# Altium schematic sheet FPGA_Banks1.SchDoc: FPGA Banks 1
size A4; Engineer: Samer Kilani; DocumentNumber: 6; SheetNumber: 6; SheetTotal: 9
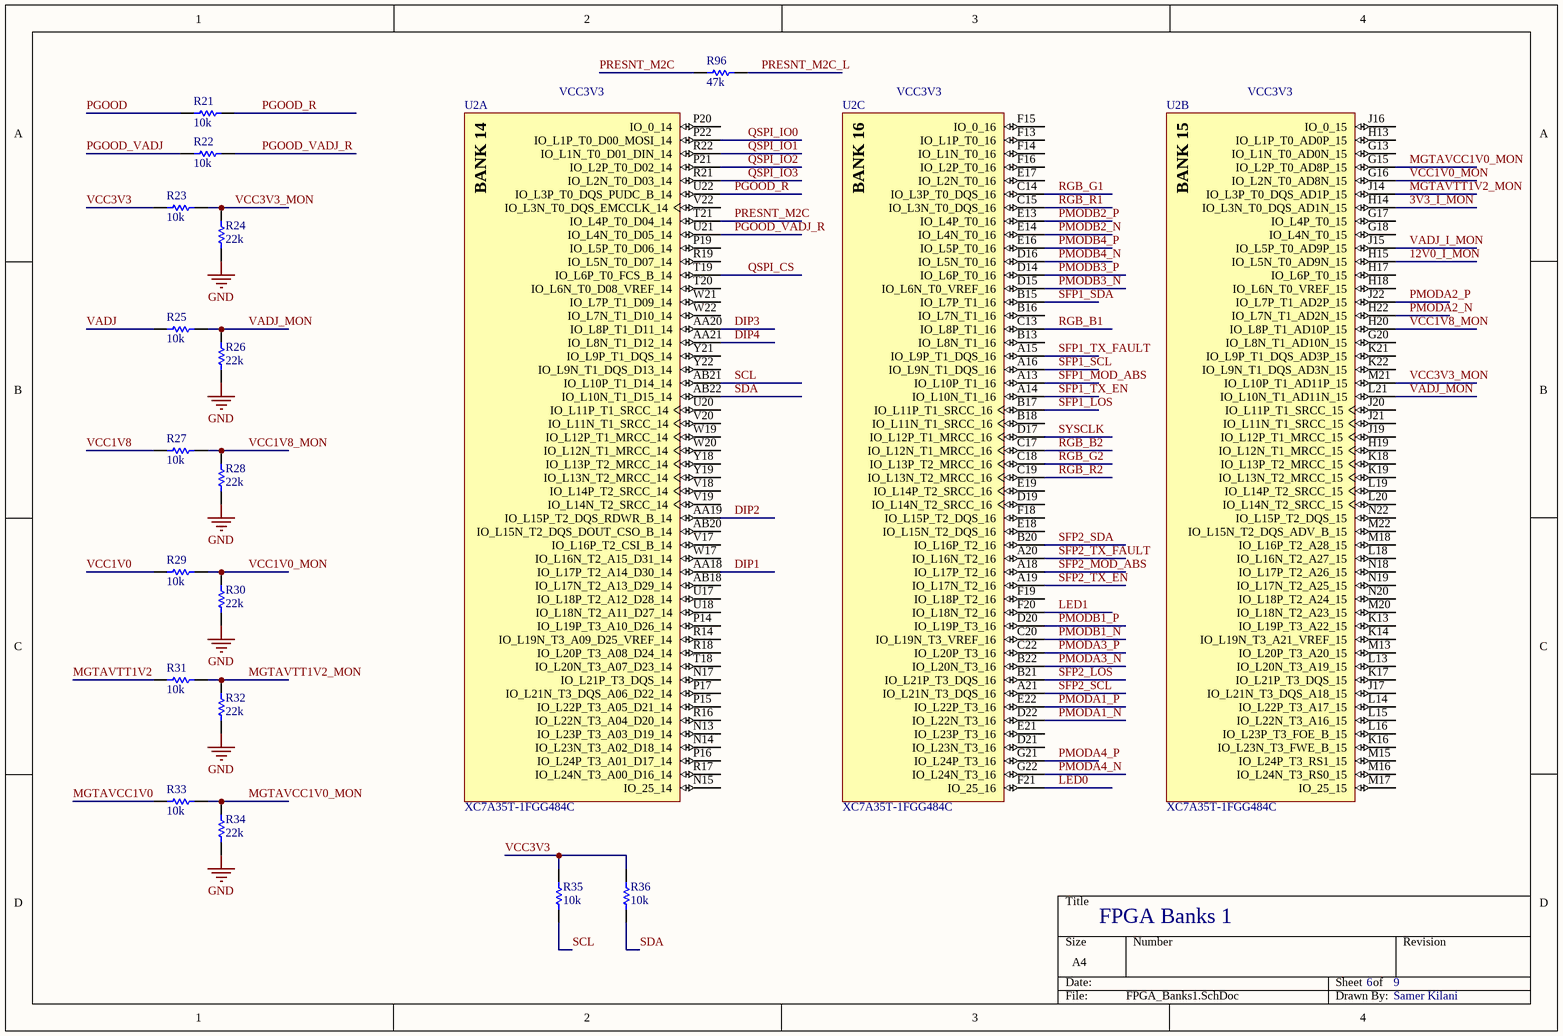
[diagram p0: FPGA_Banks1.SchDoc]

## Parts
R21  value 10k  [R0402]  (hidden comment: Res)
R22  value 10k  [R0402]  (hidden comment: Res)
R23  value 10k  [R0402]  (hidden comment: Res)
R24  value 22k  [R0402]  (hidden comment: Res)
R25  value 10k  [R0402]  (hidden comment: Res)
R26  value 22k  [R0402]  (hidden comment: Res)
R27  value 10k  [R0402]  (hidden comment: Res)
R28  value 22k  [R0402]  (hidden comment: Res)
R29  value 10k  [R0402]  (hidden comment: Res)
R30  value 22k  [R0402]  (hidden comment: Res)
R31  value 10k  [R0402]  (hidden comment: Res)
R32  value 22k  [R0402]  (hidden comment: Res)
R33  value 10k  [R0402]  (hidden comment: Res)
R34  value 22k  [R0402]  (hidden comment: Res)
R35  value 10k  [R0402]  (hidden comment: Res)
R36  value 10k  [R0402]  (hidden comment: Res)
R96  value 47k  [R0402]  (hidden comment: Res)
U2  XC7A35T-1FGG484C  [FGG484]  (parts A,B,C of 12)

## Nets
GND: R24.2 R26.2 R28.2 R30.2 R32.2 R34.2
3V3_I_MON: U2.H14(IO_L3N_T0_DQS_AD1N_15)
12V0_I_MON: U2.H15(IO_L5N_T0_AD9N_15)
DIP1: U2.AA18(IO_L17P_T2_A14_D30_14)
DIP2: U2.AA19(IO_L15P_T2_DQS_RDWR_B_14)
DIP3: U2.AA20(IO_L8P_T1_D11_14)
DIP4: U2.AA21(IO_L8N_T1_D12_14)
LED0: U2.F21(IO_25_16)
LED1: U2.F20(IO_L18N_T2_16)
MGTAVCC1V0: R33.2
MGTAVCC1V0_MON: R33.1 R34.1 U2.G15(IO_L2P_T0_AD8P_15)
MGTAVTT1V2: R31.2
MGTAVTT1V2_MON: R31.1 R32.1 U2.J14(IO_L3P_T0_DQS_AD1P_15)
PGOOD: R21.2
PGOOD_R: R21.1 U2.U22(IO_L3P_T0_DQS_PUDC_B_14)
PGOOD_VADJ: R22.2
PGOOD_VADJ_R: R22.1 U2.U21(IO_L4N_T0_D05_14)
PMODA1_N: U2.D22(IO_L22N_T3_16)
PMODA1_P: U2.E22(IO_L22P_T3_16)
PMODA2_N: U2.H22(IO_L7N_T1_AD2N_15)
PMODA2_P: U2.J22(IO_L7P_T1_AD2P_15)
PMODA3_N: U2.B22(IO_L20N_T3_16)
PMODA3_P: U2.C22(IO_L20P_T3_16)
PMODA4_N: U2.G22(IO_L24N_T3_16)
PMODA4_P: U2.G21(IO_L24P_T3_16)
PMODB1_N: U2.C20(IO_L19N_T3_VREF_16)
PMODB1_P: U2.D20(IO_L19P_T3_16)
PMODB2_N: U2.E14(IO_L4N_T0_16)
PMODB2_P: U2.E13(IO_L4P_T0_16)
PMODB3_N: U2.D15(IO_L6N_T0_VREF_16)
PMODB3_P: U2.D14(IO_L6P_T0_16)
PMODB4_N: U2.D16(IO_L5N_T0_16)
PMODB4_P: U2.E16(IO_L5P_T0_16)
PRESNT_M2C: R96.2 U2.T21(IO_L4P_T0_D04_14)
PRESNT_M2C_L: R96.1
QSPI_CS: U2.T19(IO_L6P_T0_FCS_B_14)
QSPI_IO0: U2.P22(IO_L1P_T0_D00_MOSI_14)
QSPI_IO1: U2.R22(IO_L1N_T0_D01_DIN_14)
QSPI_IO2: U2.P21(IO_L2P_T0_D02_14)
QSPI_IO3: U2.R21(IO_L2N_T0_D03_14)
RGB_B1: U2.C13(IO_L8P_T1_16)
RGB_B2: U2.C17(IO_L12N_T1_MRCC_16)
RGB_G1: U2.C14(IO_L3P_T0_DQS_16)
RGB_G2: U2.C18(IO_L13P_T2_MRCC_16)
RGB_R1: U2.C15(IO_L3N_T0_DQS_16)
RGB_R2: U2.C19(IO_L13N_T2_MRCC_16)
SCL: R35.2 U2.AB21(IO_L10P_T1_D14_14)
SDA: R36.2 U2.AB22(IO_L10N_T1_D15_14)
SFP1_LOS: U2.B17(IO_L11P_T1_SRCC_16)
SFP1_MOD_ABS: U2.A13(IO_L10P_T1_16)
SFP1_SCL: U2.A16(IO_L9N_T1_DQS_16)
SFP1_SDA: U2.B15(IO_L7P_T1_16)
SFP1_TX_EN: U2.A14(IO_L10N_T1_16)
SFP1_TX_FAULT: U2.A15(IO_L9P_T1_DQS_16)
SFP2_LOS: U2.B21(IO_L21P_T3_DQS_16)
SFP2_MOD_ABS: U2.A18(IO_L17P_T2_16)
SFP2_SCL: U2.A21(IO_L21N_T3_DQS_16)
SFP2_SDA: U2.B20(IO_L16P_T2_16)
SFP2_TX_EN: U2.A19(IO_L17N_T2_16)
SFP2_TX_FAULT: U2.A20(IO_L16N_T2_16)
SYSCLK: U2.D17(IO_L12P_T1_MRCC_16)
VADJ: R25.2
VADJ_I_MON: U2.J15(IO_L5P_T0_AD9P_15)
VADJ_MON: R25.1 R26.1 U2.L21(IO_L10N_T1_AD11N_15)
VCC1V0: R29.2
VCC1V0_MON: R29.1 R30.1 U2.G16(IO_L2N_T0_AD8N_15)
VCC1V8: R27.2
VCC1V8_MON: R27.1 R28.1 U2.H20(IO_L8P_T1_AD10P_15)
VCC3V3: R23.2 R35.1 R36.1
VCC3V3_MON: R23.1 R24.1 U2.M21(IO_L10P_T1_AD11P_15)

Not connected (* = marked no-connect by the designer): U2 AB18(IO_L17N_T2_A13_D29_14) AB20(IO_L15N_T2_DQS_DOUT_CSO_B_14) B13(IO_L8N_T1_16) B16(IO_L7N_T1_16) B18(IO_L11N_T1_SRCC_16) D19(IO_L14N_T2_SRCC_16) D21(IO_L23N_T3_16) E17(IO_L2N_T0_16) E18(IO_L15N_T2_DQS_16) E19(IO_L14P_T2_SRCC_16) E21(IO_L23P_T3_16) F13(IO_L1P_T0_16) F14(IO_L1N_T0_16) F15(IO_0_16) F16(IO_L2P_T0_16) F18(IO_L15P_T2_DQS_16) F19(IO_L18P_T2_16) G13(IO_L1N_T0_AD0N_15) G17(IO_L4P_T0_15) G18(IO_L4N_T0_15) G20(IO_L8N_T1_AD10N_15) H13(IO_L1P_T0_AD0P_15) H17(IO_L6P_T0_15) H18(IO_L6N_T0_VREF_15) H19(IO_L12N_T1_MRCC_15) J16(IO_0_15) J17(IO_L21N_T3_DQS_A18_15) J19(IO_L12P_T1_MRCC_15) J20(IO_L11P_T1_SRCC_15) J21(IO_L11N_T1_SRCC_15) K13(IO_L19P_T3_A22_15) K14(IO_L19N_T3_A21_VREF_15) K16(IO_L23N_T3_FWE_B_15) K17(IO_L21P_T3_DQS_15) K18(IO_L13P_T2_MRCC_15) K19(IO_L13N_T2_MRCC_15) K21(IO_L9P_T1_DQS_AD3P_15) K22(IO_L9N_T1_DQS_AD3N_15) L13(IO_L20N_T3_A19_15) L14(IO_L22P_T3_A17_15) L15(IO_L22N_T3_A16_15) L16(IO_L23P_T3_FOE_B_15) L18(IO_L16N_T2_A27_15) L19(IO_L14P_T2_SRCC_15) L20(IO_L14N_T2_SRCC_15) M13(IO_L20P_T3_A20_15) M15(IO_L24P_T3_RS1_15) M16(IO_L24N_T3_RS0_15) M17(IO_25_15) M18(IO_L16P_T2_A28_15) M20(IO_L18N_T2_A23_15) M22(IO_L15N_T2_DQS_ADV_B_15) N13(IO_L23P_T3_A03_D19_14) N14(IO_L23N_T3_A02_D18_14) N15(IO_25_14) N17(IO_L21P_T3_DQS_14) N18(IO_L17P_T2_A26_15) N19(IO_L17N_T2_A25_15) N20(IO_L18P_T2_A24_15) N22(IO_L15P_T2_DQS_15) P14(IO_L19P_T3_A10_D26_14) P15(IO_L22P_T3_A05_D21_14) P16(IO_L24P_T3_A01_D17_14) P17(IO_L21N_T3_DQS_A06_D22_14) P19(IO_L5P_T0_D06_14) P20(IO_0_14) R14(IO_L19N_T3_A09_D25_VREF_14) R16(IO_L22N_T3_A04_D20_14) R17(IO_L24N_T3_A00_D16_14) R18(IO_L20P_T3_A08_D24_14) R19(IO_L5N_T0_D07_14) T18(IO_L20N_T3_A07_D23_14) T20(IO_L6N_T0_D08_VREF_14) U17(IO_L18P_T2_A12_D28_14) U18(IO_L18N_T2_A11_D27_14) U20(IO_L11P_T1_SRCC_14) V17(IO_L16P_T2_CSI_B_14) V18(IO_L14P_T2_SRCC_14) V19(IO_L14N_T2_SRCC_14) V20(IO_L11N_T1_SRCC_14) V22(IO_L3N_T0_DQS_EMCCLK_14) W17(IO_L16N_T2_A15_D31_14) W19(IO_L12P_T1_MRCC_14) W20(IO_L12N_T1_MRCC_14) W21(IO_L7P_T1_D09_14) W22(IO_L7N_T1_D10_14) Y18(IO_L13P_T2_MRCC_14) Y19(IO_L13N_T2_MRCC_14) Y21(IO_L9P_T1_DQS_14) Y22(IO_L9N_T1_DQS_D13_14)

## Notes on the sheet
- VCC3V3
- (in symbol XC7A35T-1FGG484C, part A) BANK 14
- (in symbol XC7A35T-1FGG484C, part B) BANK 15
- (in symbol XC7A35T-1FGG484C, part C) BANK 16

## Library data of the parts
R21-R36 R96 = Res: Resistor
U2 = XC7A35T-1FGG484C: Artix-7 FPGA, 250 User I/Os, 4 GTP, 484-Ball BGA, Speed Grade 1, Commercial Grade, Pb-Free; Manufacturer: Xilinx; Total Block RAM: 1800 Kb; GTP: 4; Clock Mgmt Tiles (CMTs): 5; Logic Cells: 33280; Available User I/O: 250; Speed Grades: 1; DatasheetVersion: v1.15; PackageVersion: Rev. 1.11; PackageReference: FGG484; PackageDescription: 484-Ball Wire-Bond Fine-Pitch BGA, Body 23 x 23 mm, Pitch 1 mm; Maximum Distributed RAM: 400 Kb; Operating Temperature Range: Commercial; NexusDeviceID: XC7A35T-1FGG484C; Mounting Technology: Surface Mount; PartNumber: XC7A35T-1FGG484C; ComponentLink1Description: Manufacturer URL; ComponentLink1URL: http://www.xilinx.com/; ComponentLink2Description: Datasheet; ComponentLink2URL: http://www.xilinx.com/support/documentation/data_sheets/ds180_7Series_Overview.pdf; ComponentLink3Description: Package Specification; ComponentLink3URL: http://www.xilinx.com/support/documentation/user_guides/ug475_7Series_Pkg_Pinout.pdf; ComponentLink4Description: DC and Switching Characteristics; ComponentLink4URL: http://www.xilinx.com/support/documentation/data_sheets/ds181_Artix_7_Data_Sheet.pdf; ComponentLink5Description: Package File; ComponentLink5URL: http://www.xilinx.com/support/packagefiles/a7packages/xc7a200tsbg484pkg.txt; ComponentLink6Description: Packaging and Pinout; ComponentLink6URL: http://www.xilinx.com/support/documentation/user_guides/ug475_7Series_Pkg_Pinout.pdf